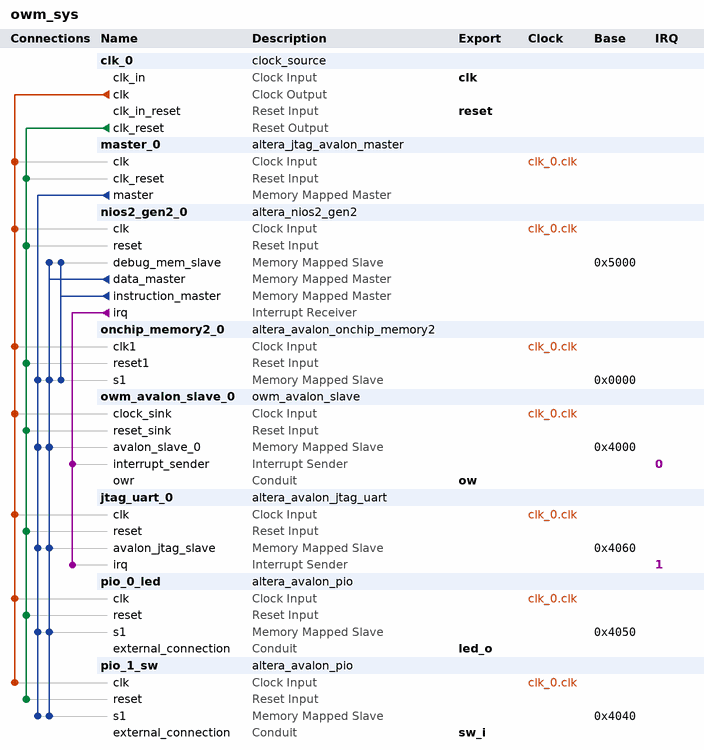
[diagram p0: system contents]
# Platform Designer (Qsys) system owm_sys, Cyclone IV E EP4CE22F17C6
# Parameters at their usual value, and those the tool derives, are not listed.
package require -exact qsys 15.1
create_system owm_sys
set_project_property DEVICE_FAMILY {Cyclone IV E}
set_project_property DEVICE EP4CE22F17C6

add_instance clk_0 clock_source 15.1
set_instance_parameter_value clk_0 clockFrequency 50000000
set_instance_parameter_value clk_0 resetSynchronousEdges DEASSERT

add_instance master_0 altera_jtag_avalon_master 15.1

add_instance nios2_gen2_0 altera_nios2_gen2 15.1
set_instance_parameter_value nios2_gen2_0 dcache_size 2048
set_instance_parameter_value nios2_gen2_0 exceptionSlave onchip_memory2_0.s1
set_instance_parameter_value nios2_gen2_0 icache_size 4096
set_instance_parameter_value nios2_gen2_0 impl Tiny
set_instance_parameter_value nios2_gen2_0 resetSlave onchip_memory2_0.s1

add_instance onchip_memory2_0 altera_avalon_onchip_memory2 15.1
set_instance_parameter_value onchip_memory2_0 dataWidth 32
set_instance_parameter_value onchip_memory2_0 dualPort false
set_instance_parameter_value onchip_memory2_0 initMemContent true
set_instance_parameter_value onchip_memory2_0 initializationFileName onchip_mem.hex
set_instance_parameter_value onchip_memory2_0 memorySize 16384

add_instance owm_avalon_slave_0 owm_avalon_slave 1.0
set_instance_parameter_value owm_avalon_slave_0 OW_BUS_NUM 1

add_instance jtag_uart_0 altera_avalon_jtag_uart 15.1
set_instance_parameter_value jtag_uart_0 simInteractiveOptions NO_INTERACTIVE_WINDOWS

add_instance pio_0_led altera_avalon_pio 15.1
set_instance_parameter_value pio_0_led direction Output
set_instance_parameter_value pio_0_led width 8

add_instance pio_1_sw altera_avalon_pio 15.1
set_instance_parameter_value pio_1_sw direction Input
set_instance_parameter_value pio_1_sw width 4

# connections
add_connection clk_0.clk jtag_uart_0.clk clock
add_connection clk_0.clk master_0.clk clock
add_connection clk_0.clk nios2_gen2_0.clk clock
add_connection clk_0.clk onchip_memory2_0.clk1 clock
add_connection clk_0.clk owm_avalon_slave_0.clock_sink clock
add_connection clk_0.clk pio_0_led.clk clock
add_connection clk_0.clk pio_1_sw.clk clock
add_connection clk_0.clk_reset jtag_uart_0.reset reset
add_connection clk_0.clk_reset master_0.clk_reset reset
add_connection clk_0.clk_reset nios2_gen2_0.reset reset
add_connection clk_0.clk_reset onchip_memory2_0.reset1 reset
add_connection clk_0.clk_reset owm_avalon_slave_0.reset_sink reset
add_connection clk_0.clk_reset pio_0_led.reset reset
add_connection clk_0.clk_reset pio_1_sw.reset reset
add_connection master_0.master jtag_uart_0.avalon_jtag_slave avalon
set_connection_parameter_value master_0.master/jtag_uart_0.avalon_jtag_slave baseAddress 0x4060
add_connection master_0.master onchip_memory2_0.s1 avalon
set_connection_parameter_value master_0.master/onchip_memory2_0.s1 baseAddress 0x0000
add_connection master_0.master owm_avalon_slave_0.avalon_slave_0 avalon
set_connection_parameter_value master_0.master/owm_avalon_slave_0.avalon_slave_0 baseAddress 0x4000
add_connection master_0.master pio_0_led.s1 avalon
set_connection_parameter_value master_0.master/pio_0_led.s1 baseAddress 0x4050
add_connection master_0.master pio_1_sw.s1 avalon
set_connection_parameter_value master_0.master/pio_1_sw.s1 baseAddress 0x4040
add_connection nios2_gen2_0.data_master jtag_uart_0.avalon_jtag_slave avalon
set_connection_parameter_value nios2_gen2_0.data_master/jtag_uart_0.avalon_jtag_slave baseAddress 0x4060
add_connection nios2_gen2_0.data_master nios2_gen2_0.debug_mem_slave avalon
set_connection_parameter_value nios2_gen2_0.data_master/nios2_gen2_0.debug_mem_slave baseAddress 0x5000
add_connection nios2_gen2_0.data_master onchip_memory2_0.s1 avalon
set_connection_parameter_value nios2_gen2_0.data_master/onchip_memory2_0.s1 baseAddress 0x0000
add_connection nios2_gen2_0.data_master owm_avalon_slave_0.avalon_slave_0 avalon
set_connection_parameter_value nios2_gen2_0.data_master/owm_avalon_slave_0.avalon_slave_0 baseAddress 0x4000
add_connection nios2_gen2_0.data_master pio_0_led.s1 avalon
set_connection_parameter_value nios2_gen2_0.data_master/pio_0_led.s1 baseAddress 0x4050
add_connection nios2_gen2_0.data_master pio_1_sw.s1 avalon
set_connection_parameter_value nios2_gen2_0.data_master/pio_1_sw.s1 baseAddress 0x4040
add_connection nios2_gen2_0.instruction_master nios2_gen2_0.debug_mem_slave avalon
set_connection_parameter_value nios2_gen2_0.instruction_master/nios2_gen2_0.debug_mem_slave baseAddress 0x5000
add_connection nios2_gen2_0.instruction_master onchip_memory2_0.s1 avalon
set_connection_parameter_value nios2_gen2_0.instruction_master/onchip_memory2_0.s1 baseAddress 0x0000
add_connection nios2_gen2_0.irq jtag_uart_0.irq interrupt
set_connection_parameter_value nios2_gen2_0.irq/jtag_uart_0.irq irqNumber 1
add_connection nios2_gen2_0.irq owm_avalon_slave_0.interrupt_sender interrupt
set_connection_parameter_value nios2_gen2_0.irq/owm_avalon_slave_0.interrupt_sender irqNumber 0

# exported interfaces
add_interface clk clock sink
set_interface_property clk EXPORT_OF clk_0.clk_in
add_interface led_o conduit end
set_interface_property led_o EXPORT_OF pio_0_led.external_connection
add_interface ow conduit end
set_interface_property ow EXPORT_OF owm_avalon_slave_0.owr
add_interface reset reset sink
set_interface_property reset EXPORT_OF clk_0.clk_in_reset
add_interface sw_i conduit end
set_interface_property sw_i EXPORT_OF pio_1_sw.external_connection

set_interconnect_requirement {$system} qsys_mm.clockCrossingAdapter HANDSHAKE
set_interconnect_requirement {$system} qsys_mm.enableEccProtection FALSE
set_interconnect_requirement {$system} qsys_mm.insertDefaultSlave FALSE
set_interconnect_requirement {$system} qsys_mm.maxAdditionalLatency 1

save_system owm_sys.qsys
